# EAGLE design Test (EAGLE 9.1.3)
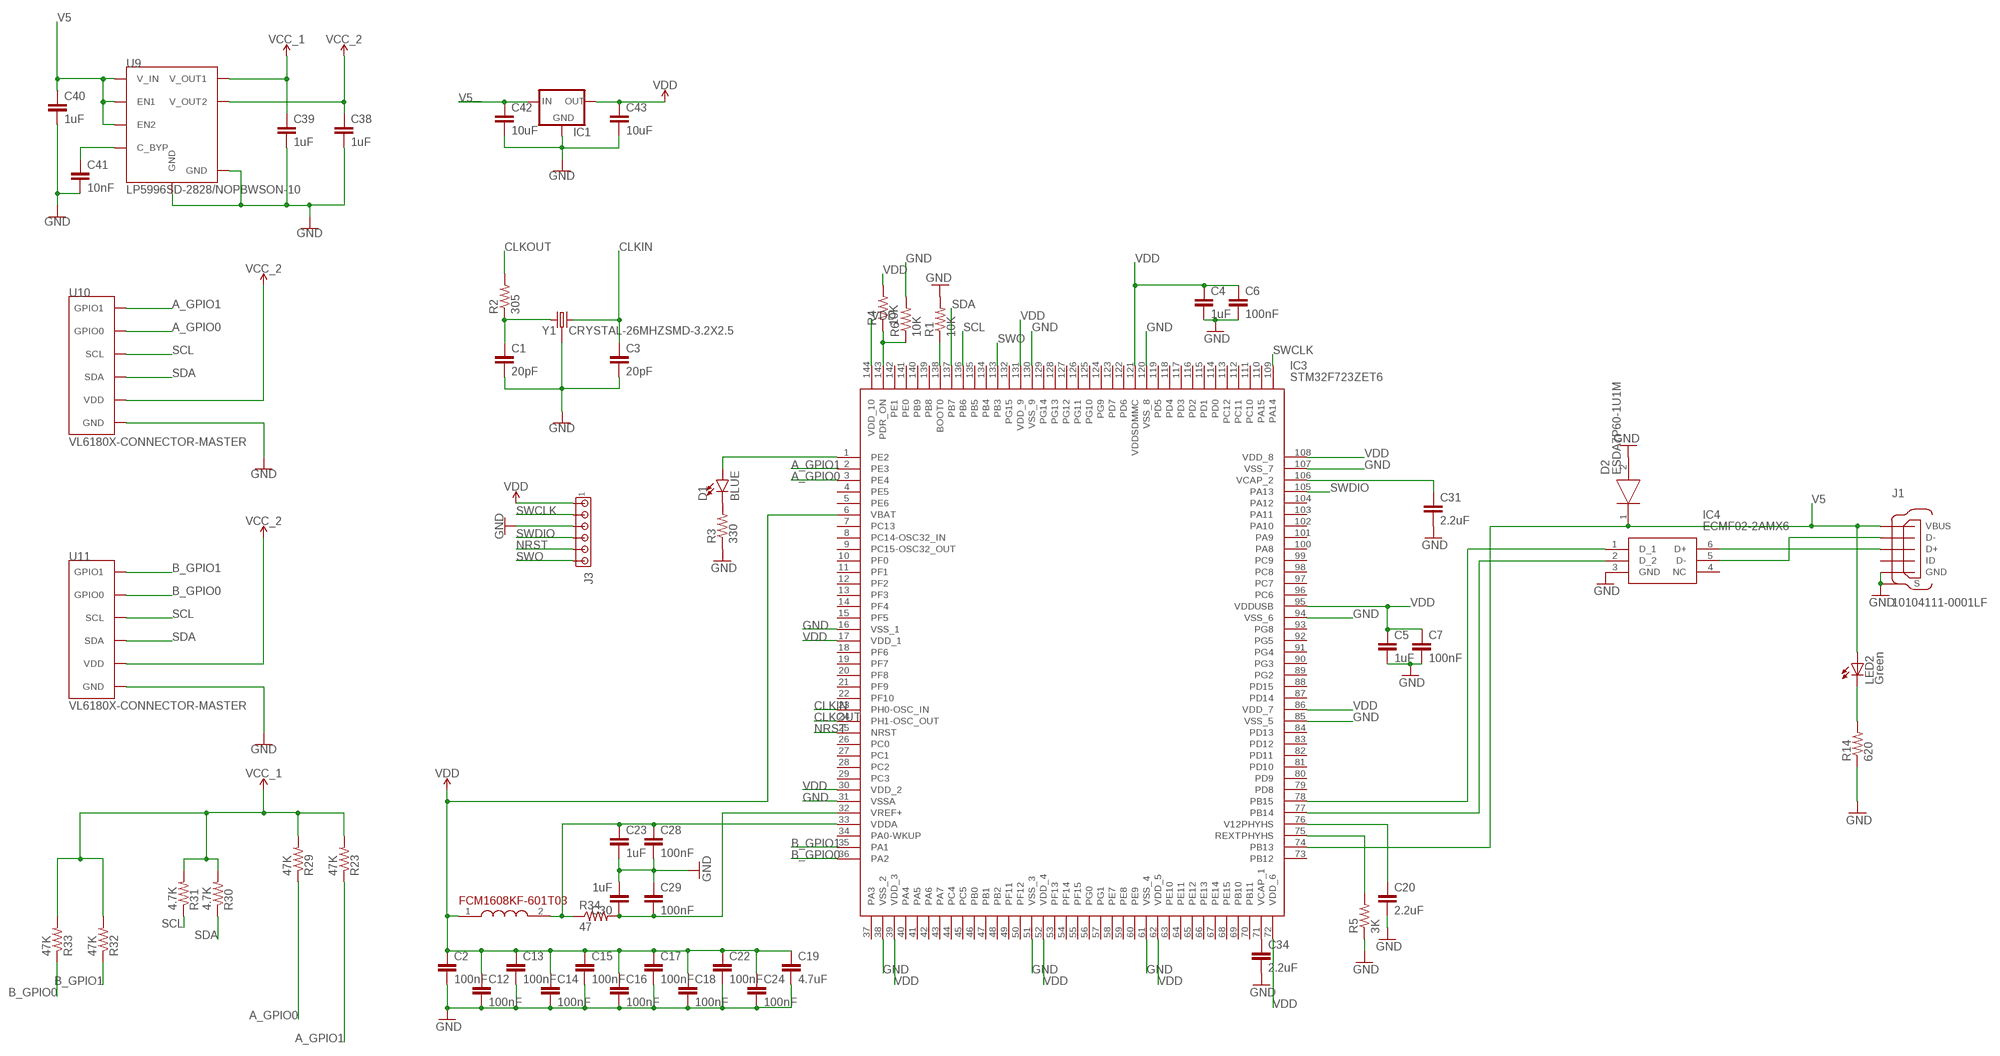
[diagram p0: schematic, sheet 1]

## Parts
C1  20pF  C-EUC0603  [C0603]
C2  100nF  C-EUC0603K  [C0603K]
C3  20pF  C-EUC0603  [C0603]
C4  1uF  C-EUC0603K  [C0603K]
C5  1uF  C-EUC0603K  [C0603K]
C6  100nF  C-EUC0603K  [C0603K]
C7  100nF  C-EUC0603K  [C0603K]
C12  100nF  C-EUC0603K  [C0603K]
C13  100nF  C-EUC0603K  [C0603K]
C14  100nF  C-EUC0603K  [C0603K]
C15  100nF  C-EUC0603K  [C0603K]
C16  100nF  C-EUC0603K  [C0603K]
C17  100nF  C-EUC0603K  [C0603K]
C18  100nF  C-EUC0603K  [C0603K]
C19  4.7uF  C-EUC0603K  [C0603K]
C20  2.2uF  C-EUC0603K  [C0603K]
C22  100nF  C-EUC0603K  [C0603K]
C23  1uF  C-EUC0603K  [C0603K]
C24  100nF  C-EUC0603K  [C0603K]
C28  100nF  C-EUC0603K  [C0603K]
C29  100nF  C-EUC0603K  [C0603K]
C30  1uF  C-EUC0603K  [C0603K]
C31  2.2uF  C-EUC0603K  [C0603K]
C34  2.2uF  C-EUC0603K  [C0603K]
C38  1uF  C-EUC0603K  [C0603K]
C39  1uF  C-EUC0603K  [C0603K]
C40  1uF  C-EUC0603K  [C0603K]
C41  10nF  C-EUC0603K  [C0603K]
C42  10uF  C-EUC0603K  [C0603K]
C43  10uF  C-EUC0603K  [C0603K]
D1  BLUE  LED-BLUE0603  [LED-0603]
D2  ESDA7P60-1U1M  [ESDA7P601U1M]
FCM1608KF  FCM1608KF-601T03  [FCM1608KF-601T03]
IC1  LM1117  [SOT223]
IC3  STM32F723ZET6  [QFP50P2200X2200X160-144N]
IC4  ECMF02-2AMX6  [SON50P150X170X55-6N]
J1  10104111-0001LF  [FRAMATOME_10104111-0001LF]
J3  MTA06-100  [10X06MTA]
LED2  Green  LEDCHIP-LED0603  [CHIP-LED0603]
R1  10K  R-US_R0603  [R0603]
R2  305  R-US_R0603  [R0603]
R3  330  R-US_R0603  [R0603]
R4  10K  R-US_R0603  [R0603]
R5  3K  R-US_R0603  [R0603]
R6  10K  R-US_R0603  [R0603]
R14  620  R-US_R0603  [R0603]
R23  47K  R-US_R0603  [R0603]
R29  47K  R-US_R0603  [R0603]
R30  4.7K  R-US_R0603  [R0603]
R31  4.7K  R-US_R0603  [R0603]
R32  47K  R-US_R0603  [R0603]
R33  47K  R-US_R0603  [R0603]
R34  47  R-US_R0603  [R0603]
U9  LP5996SD-2828/NOPBWSON-10  [WSON-10]
U10  VL6180X-CONNECTOR-MASTER  [FH33-6S-0.5SH(10)-MASTER]
U11  VL6180X-CONNECTOR-MASTER  [FH33-6S-0.5SH(10)-MASTER]
Y1  CRYSTAL-26MHZSMD-3.2X2.5  [CRYSTAL-SMD-3.2X2.5MM]

## Nets
A_GPIO0: IC3.3(PE4) R29.1 U10.2(GPIO0)
A_GPIO1: IC3.2(PE3) R23.1 U10.1(GPIO1)
B_GPIO0: IC3.36(PA2) R33.1 U11.2(GPIO0)
B_GPIO1: IC3.35(PA1) R32.1 U11.1(GPIO1)
CLKIN: C3.1 IC3.23(PH0-OSC_IN) Y1.3
CLKOUT: IC3.24(PH1-OSC_OUT) R2.2
GND: C1.2 C2.2 C3.2 C4.2 C5.2 C6.2 C7.2 C12.2 C13.2 C14.2 C15.2 C16.2 C17.2 C18.2 C19.2 C20.2 C22.2 C23.2 C24.2 C28.2 C29.1 C30.2 C31.2 C34.2 C38.2 C39.2 C40.2 C41.2 C42.2 C43.2 D2.2(A) IC1.1(GND) IC3.16(VSS_1) IC3.31(VSSA) IC3.38(VSS_2) IC3.51(VSS_3) IC3.61(VSS_4) IC3.85(VSS_5) IC3.94(VSS_6) IC3.107(VSS_7) IC3.120(VSS_8) IC3.130(VSS_9) IC4.3(GND) J1.5(GND) J1.6(S) J1.7(S) J1.8(S) J1.9(S) J3.3 R1.2 R3.1 R5.1 R6.2 R14.1 U9.6(GND) U9.11(GND) U10.6(GND) U11.6(GND) Y1.2 Y1.4
N$1: IC3.138(BOOT0) R1.1
N$2: LED2.C R14.2
N$3: C34.1 IC3.71(VCAP_1)
N$4: C20.1 IC3.76(V12PHYHS)
N$5: D1.C R3.2
N$6: C31.1 IC3.106(VCAP_2)
N$7: IC3.78(PB15) IC4.1(D_1)
N$8: IC3.77(PB14) IC4.2(D_2)
N$9: D1.A IC3.1(PE2)
N$10: C23.1 C28.1 FCM1608KF.2(2.OUT) IC3.33(VDDA) R34.1
N$11: IC4.6(D+) J1.3(D+)
N$12: C1.1 R2.1 Y1.1
N$13: IC4.5(D-) J1.2(D-)
N$14: IC3.143(PDR_ON) R4.1 R6.1
N$17: IC3.75(REXTPHYHS) R5.2
N$19: C29.2 C30.1 IC3.32(VREF+) R34.2
N$22: C41.1 U9.4(C_BYP)
NRST: IC3.25(NRST) J3.5
SCL: IC3.136(PB6) R31.1 U10.3(SCL) U11.3(SCL)
SDA: IC3.137(PB7) R30.1 U10.4(SDA) U11.4(SDA)
SWCLK: IC3.109(PA14) J3.2
SWDIO: IC3.105(PA13) J3.4
SWO: IC3.133(PB3) J3.6
V5: C40.1 C42.1 D2.1(K) IC1.3(IN) IC3.74(PB13) J1.1(VBUS) LED2.A U9.1(V_IN) U9.2(EN1) U9.3(EN2)
VCC_1: C39.1 R23.2 R29.2 R30.2 R31.2 R32.2 R33.2 U9.10(V_OUT1)
VCC_2: C38.1 U9.9(V_OUT2) U10.5(VDD) U11.5(VDD)
VDD: C2.1 C4.1 C5.1 C6.1 C7.1 C12.1 C13.1 C14.1 C15.1 C16.1 C17.1 C18.1 C19.1 C22.1 C24.1 C43.1 FCM1608KF.1(1.IN) IC1.2(OUT) IC3.6(VBAT) IC3.17(VDD_1) IC3.30(VDD_2) IC3.39(VDD_3) IC3.52(VDD_4) IC3.62(VDD_5) IC3.72(VDD_6) IC3.86(VDD_7) IC3.95(VDDUSB) IC3.108(VDD_8) IC3.121(VDDSDMMC) IC3.131(VDD_9) IC3.144(VDD_10) J3.1 R4.2
Unconnected: IC3.4(PE5) IC3.5(PE6) IC3.7(PC13) IC3.8(PC14-OSC32_IN) IC3.9(PC15-OSC32_OUT) IC3.10(PF0) IC3.11(PF1) IC3.12(PF2) IC3.13(PF3) IC3.14(PF4) IC3.15(PF5) IC3.18(PF6) IC3.19(PF7) IC3.20(PF8) IC3.21(PF9) IC3.22(PF10) IC3.26(PC0) IC3.27(PC1) IC3.28(PC2) IC3.29(PC3) IC3.34(PA0-WKUP) IC3.37(PA3) IC3.40(PA4) IC3.41(PA5) IC3.42(PA6) IC3.43(PA7) IC3.44(PC4) IC3.45(PC5) IC3.46(PB0) IC3.47(PB1) IC3.48(PB2) IC3.49(PF11) IC3.50(PF12) IC3.53(PF13) IC3.54(PF14) IC3.55(PF15) IC3.56(PG0) IC3.57(PG1) IC3.58(PE7) IC3.59(PE8) IC3.60(PE9) IC3.63(PE10) IC3.64(PE11) IC3.65(PE12) IC3.66(PE13) IC3.67(PE14) IC3.68(PE15) IC3.69(PB10) IC3.70(PB11) IC3.73(PB12) IC3.79(PD8) IC3.80(PD9) IC3.81(PD10) IC3.82(PD11) IC3.83(PD12) IC3.84(PD13) IC3.87(PD14) IC3.88(PD15) IC3.89(PG2) IC3.90(PG3) IC3.91(PG4) IC3.92(PG5) IC3.93(PG8) IC3.96(PC6) IC3.97(PC7) IC3.98(PC8) IC3.99(PC9) IC3.100(PA8) IC3.101(PA9) IC3.102(PA10) IC3.103(PA11) IC3.104(PA12) IC3.110(PA15) IC3.111(PC10) IC3.112(PC11) IC3.113(PC12) IC3.114(PD0) IC3.115(PD1) IC3.116(PD2) IC3.117(PD3) IC3.118(PD4) IC3.119(PD5) IC3.122(PD6) IC3.123(PD7) IC3.124(PG9) IC3.125(PG10) IC3.126(PG11) IC3.127(PG12) IC3.128(PG13) IC3.129(PG14) IC3.132(PG15) IC3.134(PB4) IC3.135(PB5) IC3.139(PB8) IC3.140(PB9) IC3.141(PE0) IC3.142(PE1) IC4.4(NC) J1.4(ID)

## Library data of the parts
C1-C7 C12-C20 C22-C24 C28-C31 C34 C38-C43 = rcl:C-EU: CAPACITOR, European symbol; SPICEPREFIX: C
D1 = SparkFun-LED:LED-BLUE: Blue SMD LED Used in manufacturing of various products at SparkFun Packages: 0603 - SMD 0603 package [Product Link] <http://www.digikey.com/product-detail/en/SMLE12BC7TT86/511-1589-2-ND/1641808> 1206 - SMD1206 package [Product Link] <http://www.digikey.com/product-detail/en/lite-on-inc/LTST-C150TBKT/160-1643-1-ND/573584> SparkFun Products: ESP8266 Thing-Dev Board <https://www.sparkfun.com/products/13711> RedBoard <https://www.sparkfun.com/products/12757>; PROD_ID: DIO-08575
D2 = ESDA7P60-1U1M:ESDA7P60-1U1M: STMicroelectronics ESDA7P60-1U1M Uni-Directional TVS Diode, 700W peak, 2-Pin QFN1610 Source: Datasheet <https://componentsearchengine.com/Datasheets/1/ESDA7P60-1U1M.pdf>; DESCRIPTION: STMicroelectronics ESDA7P60-1U1M Uni-Directional TVS Diode, 700W peak, 2-Pin QFN1610; HEIGHT: 0.6mm; MANUFACTURER_NAME: STMicroelectronics; MANUFACTURER_PART_NUMBER: ESDA7P60-1U1M; MOUSER_PART_NUMBER: 511-ESDA7P60-1U1M; MOUSER_PRICE-STOCK: https://www.mouser.com/Search/Refine.aspx?Keyword=511-ESDA7P60-1U1M
FCM1608KF = FCM1608KF-601T03:FCM1608KF-601T03
IC1 = v-reg-2:LM1117
IC3 = STM32F723ZET6:STM32F723ZET6: STMICROELECTRONICS - STM32F723ZET6 - \u82AF\u7247, \u5FAE\u63A7\u5236\u5668, ARM CORTEX-M7, 216MHZ, LQFP-144 Source: Datasheet <https://componentsearchengine.com/Datasheets/1/STM32F723ZET6.pdf>; DESCRIPTION: STMICROELECTRONICS - STM32F723ZET6 - \u82AF\u7247, \u5FAE\u63A7\u5236\u5668, ARM CORTEX-M7, 216MHZ, LQFP-144; HEIGHT: 1.6mm; MANUFACTURER_NAME: STMicroelectronics; MANUFACTURER_PART_NUMBER: STM32F723ZET6; MOUSER_PART_NUMBER: 511-STM32F723ZET6; MOUSER_PRICE-STOCK: https://www.mouser.com/Search/Refine.aspx?Keyword=511-STM32F723ZET6
IC4 = ECMF02-2AMX6:ECMF02-2AMX6: Common Mode Filter & ESD Prot. USB uQFN6 STMicroelectronics ECMF02 Series, Signal Filter, 200mA uQFN SMD, Flat Contact Termination, 1.8 x 1.6 x 0.5mm Source: Datasheet <https://componentsearchengine.com/Datasheets/1/ECMF02-2AMX6.pdf>; DESCRIPTION: Common Mode Filter & ESD Prot. USB uQFN6 STMicroelectronics ECMF02 Series, Signal Filter, 200mA uQFN SMD, Flat Contact Termination, 1.8 x 1.6 x 0.5mm; HEIGHT: 0.55mm; MANUFACTURER_NAME: STMicroelectronics; MANUFACTURER_PART_NUMBER: ECMF02-2AMX6; MOUSER_PART_NUMBER: 511-ECMF02-2AMX6; MOUSER_PRICE-STOCK: https://www.mouser.com/Search/Refine.aspx?Keyword=511-ECMF02-2AMX6
J1 = 10104111-0001LF:10104111-0001LF: Conn USB Type A/B RCP 5 POS 0.65mm Solder RA SMD 5 Terminal 1 Port T/R; AVAILABILITY: Good; DESCRIPTION: Micro Usb, 2.0 Type Ab, Receptacle, Th; MF: Amphenol ICC; MP: 10104111-0001LF; PACKAGE: None; PRICE: 0.50 USD
J3 = con-amp:MTA06-100: AMP connector Connection corrected 2014-09-19
LED2 = led:LED: LED OSRAM: - CHIPLED LG R971, LG N971, LY N971, LG Q971, LY Q971, LO R971, LY R971 LH N974, LH R974 LS Q976, LO Q976, LY Q976 LO Q996 - Hyper CHIPLED LW Q18S LB Q993, LB Q99A, LB R99A - SideLED LS A670, LO A670, LY A670, LG A670, LP A670 LB A673, LV A673, LT A673, LW A673 LH A674 LY A675 LS A676, LA A676, LO A676, LY A676, LW A676 LS A679, LY A679, LG A679 - Hyper Micro SIDELED® LS Y876, LA Y876, LO Y876, LY Y876 LT Y87S - SmartLED LW L88C, LW L88S LB L89C, LB L89S, LG L890 LS L89K, LO L89K, LY L89K LS L896, LA L896, LO L896, LY L896 - TOPLED LS T670, LO T670, LY T670, LG T670, LP T670 LSG T670, LSP T670, LSY T670, LOP T670, LYG T670 LG T671, LOG T671, LSG T671 LB T673, LV T673, LT T673, LW T673 LH T674 LS T676, LA T676, LO T676, LY T676, LB T676, LH T676, LSB T676, LW T676 LB T67C, LV T67C, LT T67C, LS T67K, LO T67K, LY T67K, LW E67C LS E67B, LA E67B, LO E67B, LY E67B, LB E67C, LV E67C, LT E67C LW T67C LS T679, LY T679, LG T679 LS T770, LO T770, LY T770, LG T770, LP T770 LB T773, LV T773, LT T773, LW T773 LH T774 LS E675, LA E675, LY E675, LS T675 LS T776, LA T776, LO T776, LY T776, LB T776 LHGB T686 LT T68C, LB T68C - Hyper Mini TOPLED® LB M676 - Mini TOPLED Santana® LG M470 LS M47K, LO M47K, LY M47K Source: http://www.osram.convergy.de LUXEON: - LUMILED® LXK2-PW12-R00, LXK2-PW12-S00, LXK2-PW14-U00, LXK2-PW14-V00 LXK2-PM12-R00, LXK2-PM12-S00, LXK2-PM14-U00 LXK2-PE12-Q00, LXK2-PE12-R00, LXK2-PE12-S00, LXK2-PE14-T00, LXK2-PE14-U00 LXK2-PB12-K00, LXK2-PB12-L00, LXK2-PB12-M00, LXK2-PB14-N00, LXK2-PB14-P00, LXK2-PB14-Q00 LXK2-PR12-L00, LXK2-PR12-M00, LXK2-PR14-Q00, LXK2-PR14-R00 LXK2-PD12-Q00, LXK2-PD12-R00, LXK2-PD12-S00 LXK2-PH12-R00, LXK2-PH12-S00 LXK2-PL12-P00, LXK2-PL12-Q00, LXK2-PL12-R00 Source: www.luxeon.com KINGBRIGHT: KA-3528ASYC Source: www.kingbright.com
R1-R6 R14 R23 R29-R34 = rcl:R-US_: RESISTOR, American symbol; SPICEPREFIX: R
U9 = optical_tof_lib:LP5996SD-2828/NOPB: Dual 2.8V Output LDO. Vo1 supplies up to 150ma, Vo2 supplies up to 300ma - LP5996SD-2828/NOPB <http://www.ti.com/lit/ds/symlink/lp5996.pdf>
U10 U11 = optical_tof_lib:VL6180X-CONNECTOR-MASTER: A connector that goes on the master board (i.e board that has microcontroller) in order to connect with a VL6180X sensor through a flex cable Connector <https://www.digikey.com/product-detail/en/hirose-electric-co-ltd/FH33-6S-0.5SH(10)/HFS06CT-ND/1305357> VL6180X <http://www.st.com/content/ccc/resource/technical/document/datasheet/c4/11/28/86/e6/26/44/b3/DM00112632.pdf/files/DM00112632.pdf/jcr:content/translations/en.DM00112632.pdf>
Y1 = SparkFun-Clocks:CRYSTAL-26MHZ: 26MHz Crystal w/ Ground Pin Digikey Example <http://www.digikey.com/product-detail/en/epson/TSX-3225%2026.0000MF09Z-AC3/SER3627CT-ND/1802878> Frequency: 26MHz Frequency Stability: ±9ppm Frequency Tolerance: ±10ppm Load Capacitance: 9pF SparkFun Products: SparkFun ESP32 Thing <https://www.sparkfun.com/products/13907> SparkFun ESP8266 Thing Dev Board <https://www.sparkfun.com/products/13711>; PROD_ID: XTAL-12454

## Net classes
0 default: drill 0.356 mm

## Board
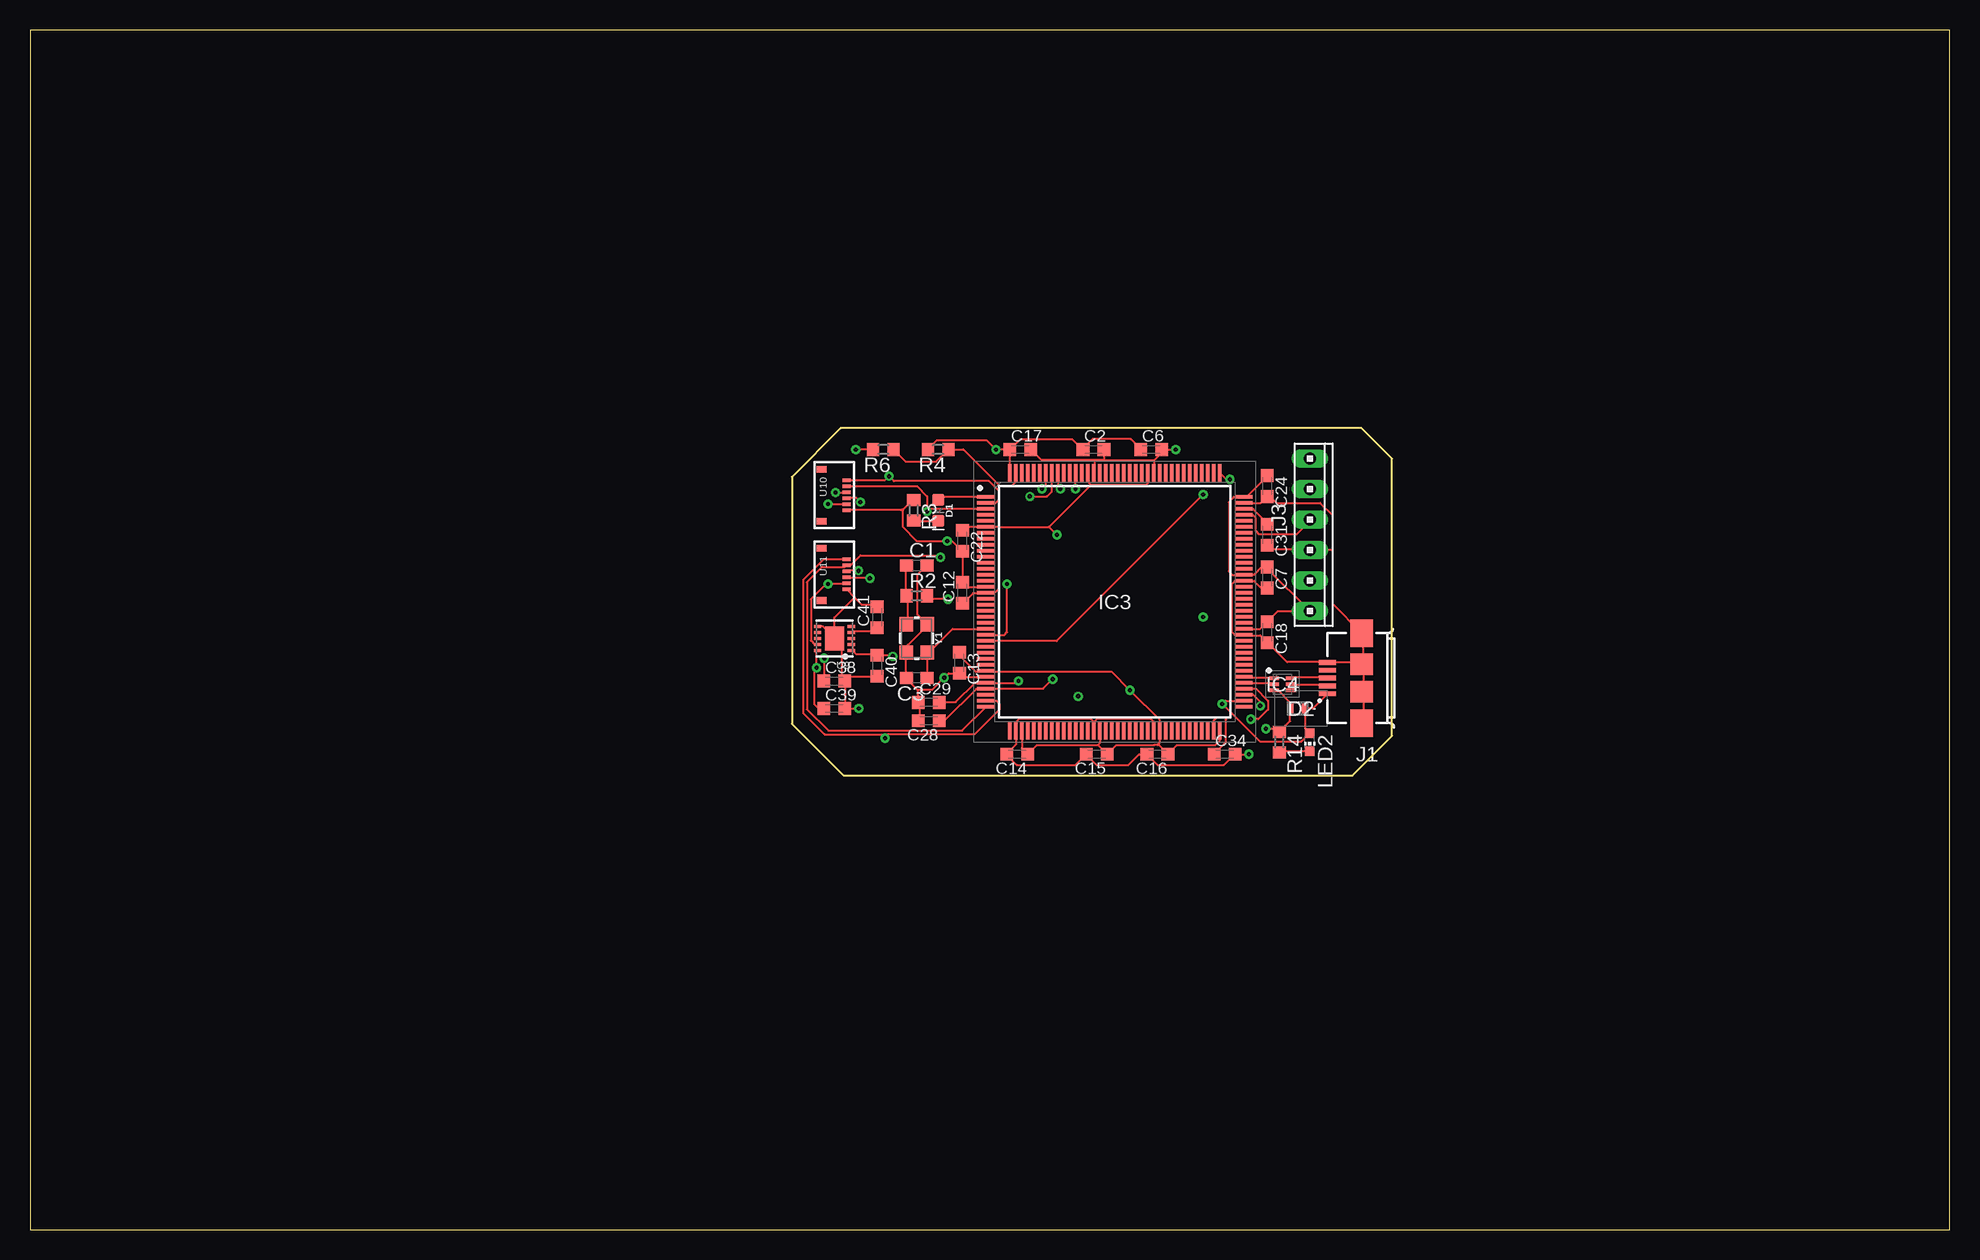
[diagram p1: board, top side]
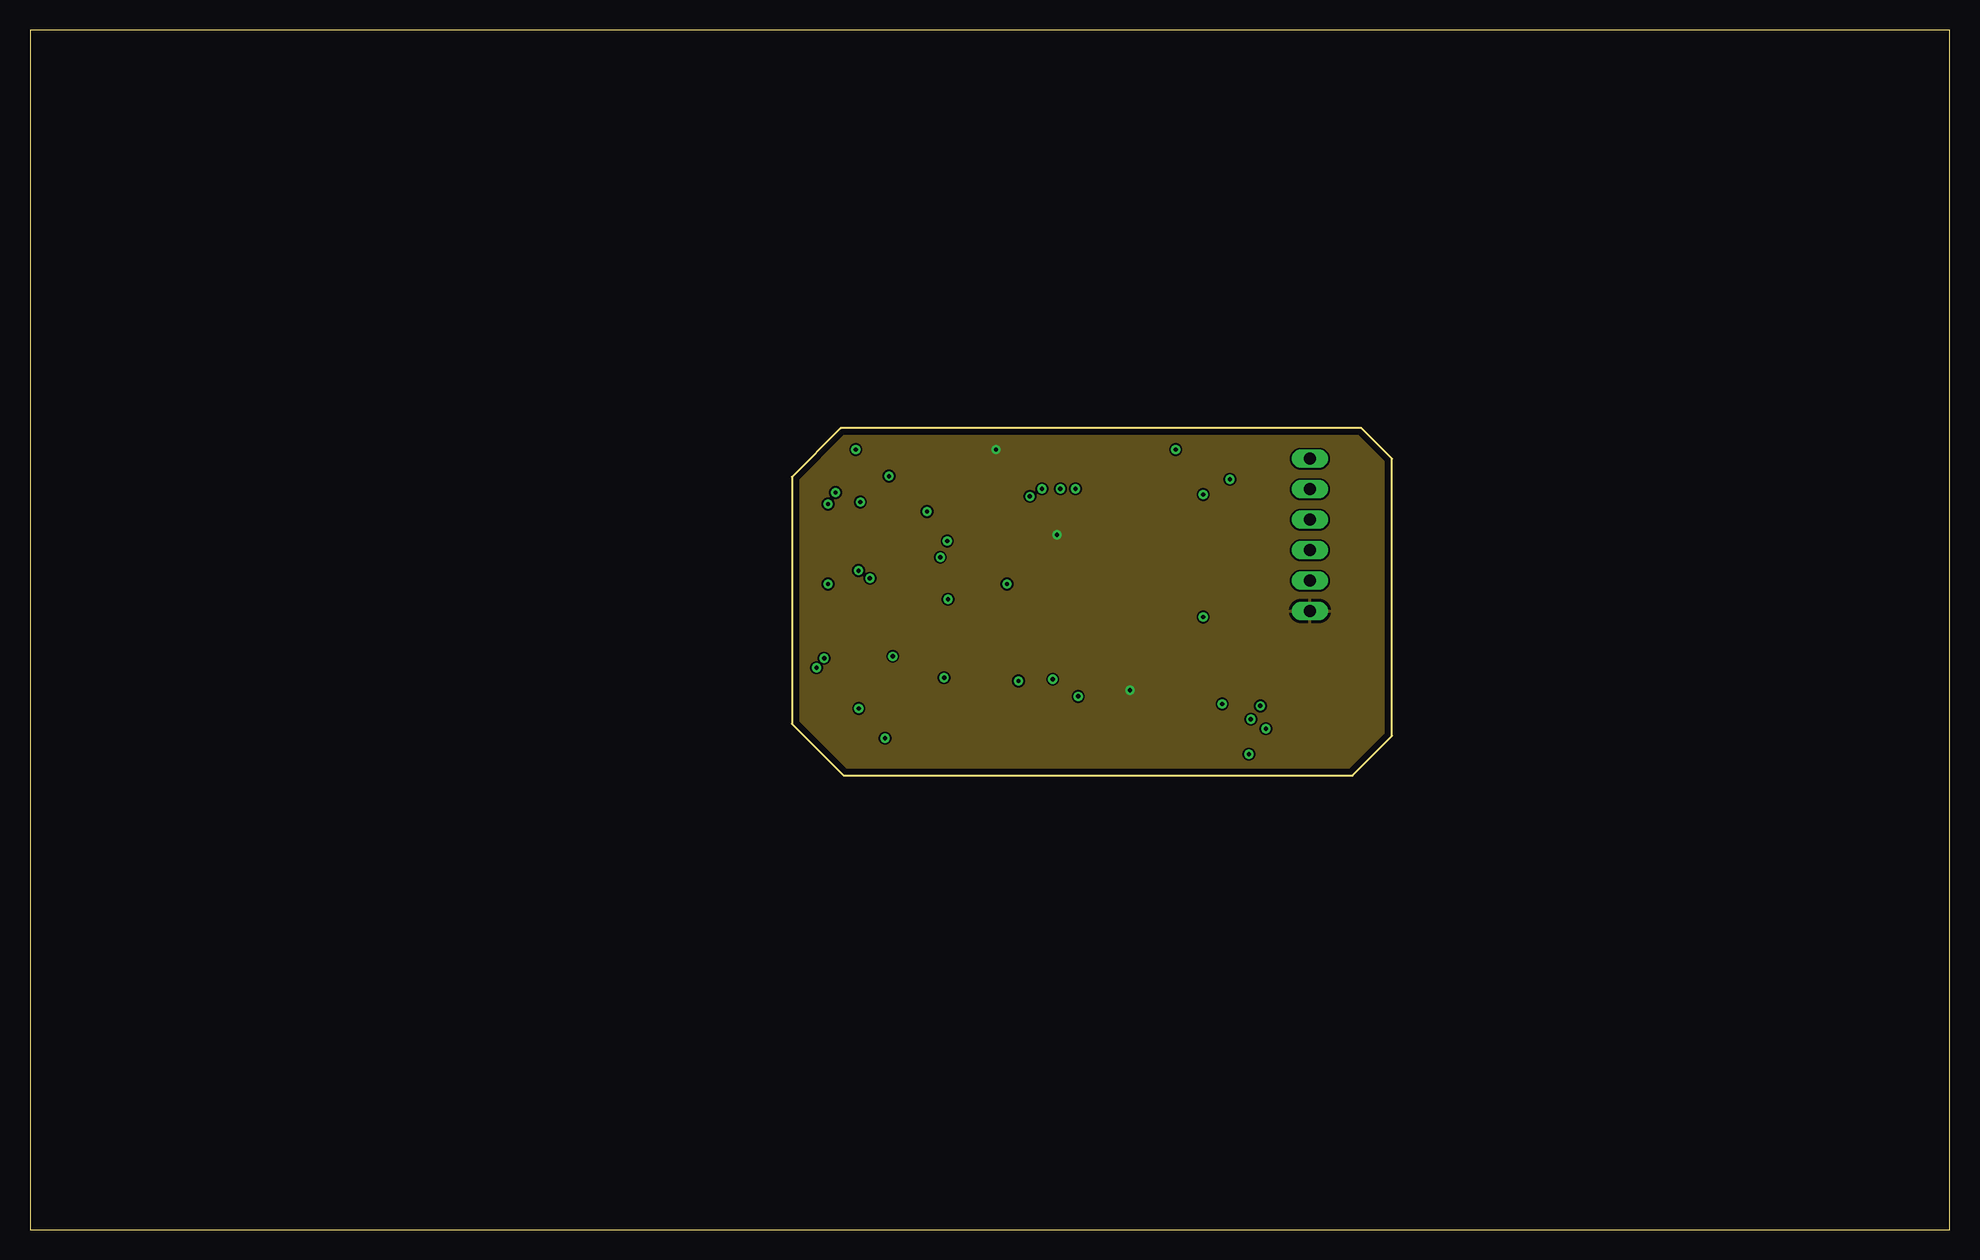
[diagram p2: board, inner layer Route2]
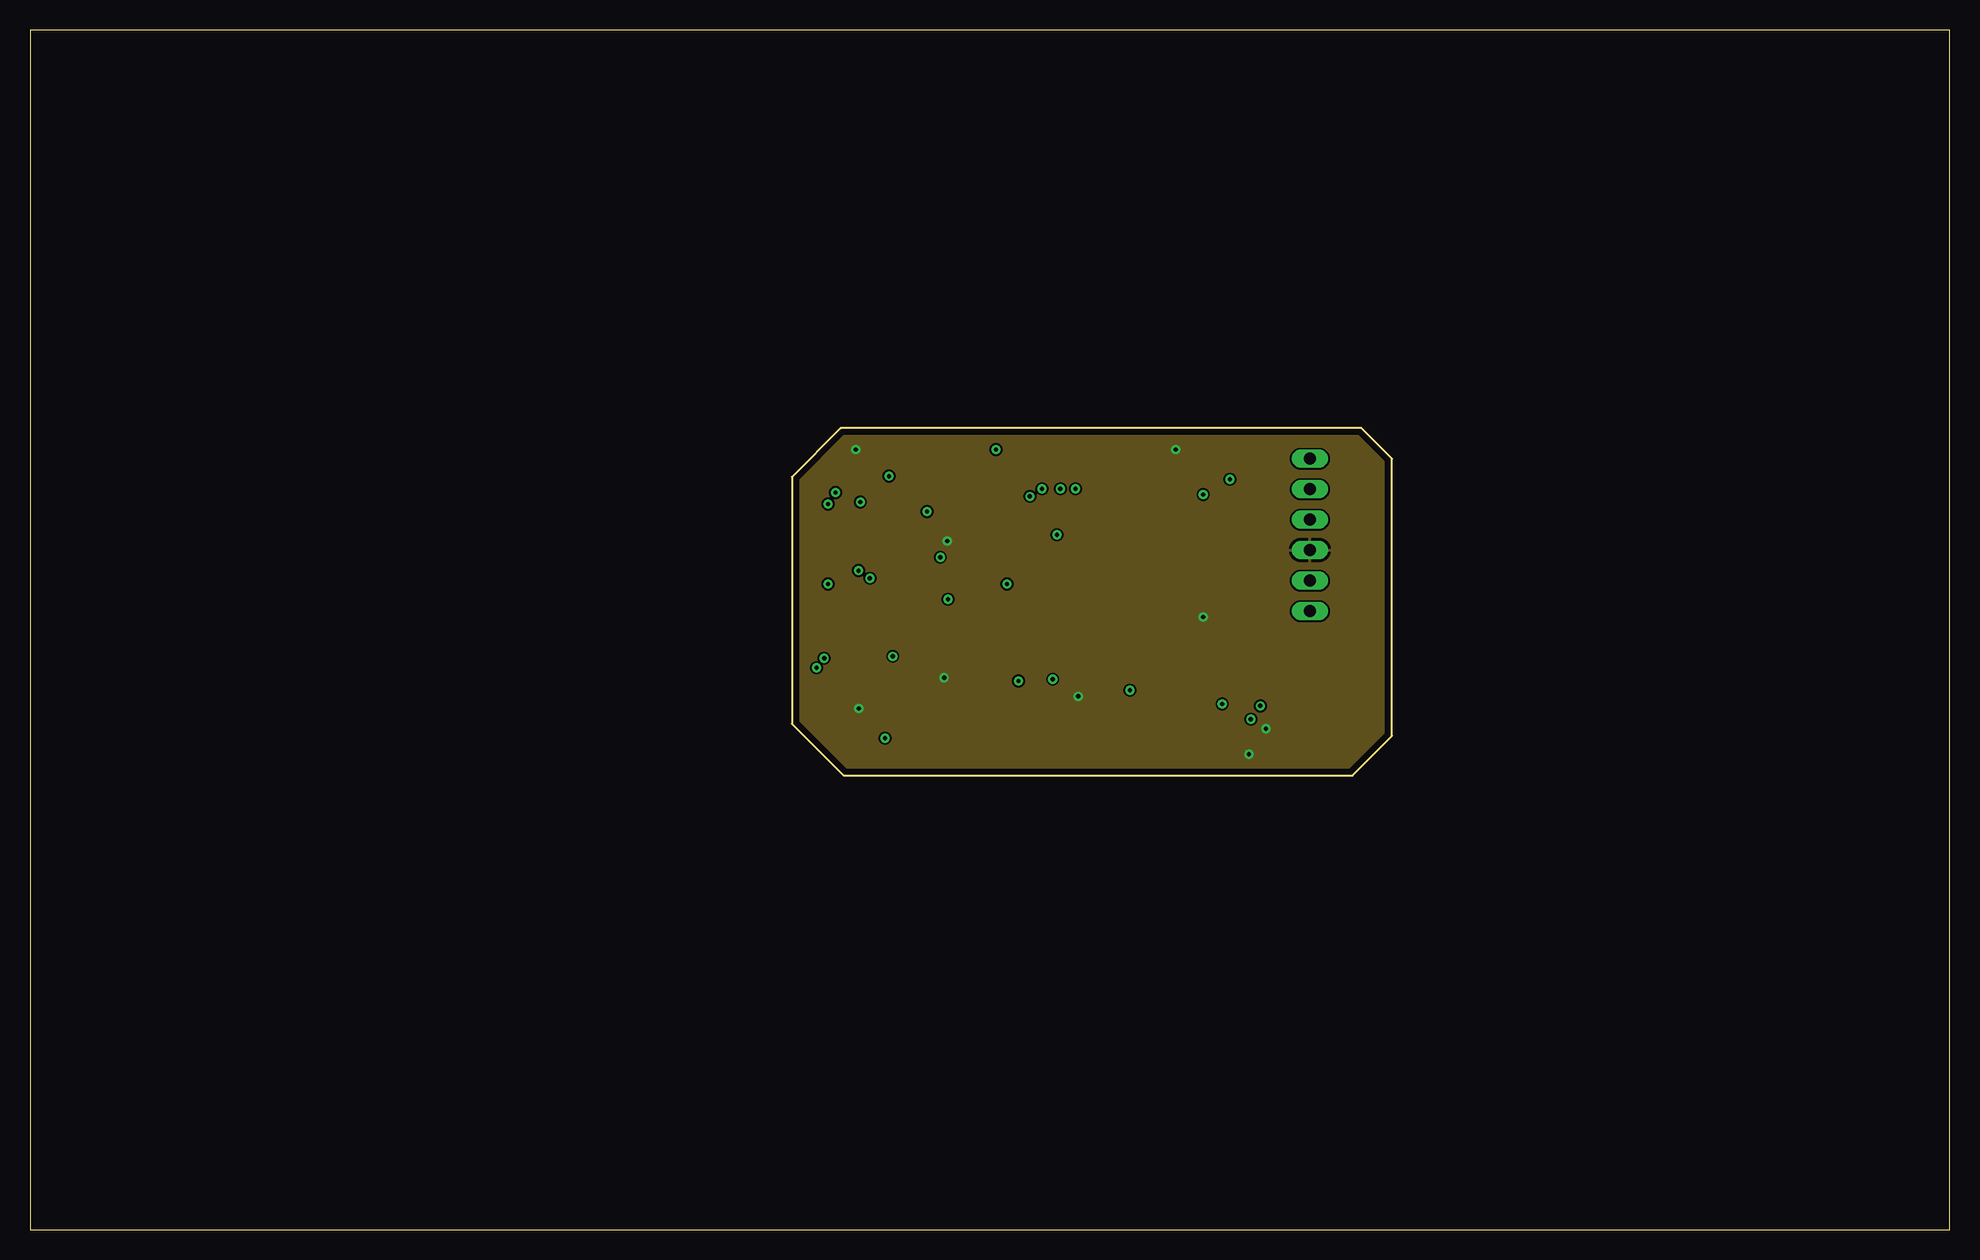
[diagram p3: board, inner layer Route15]
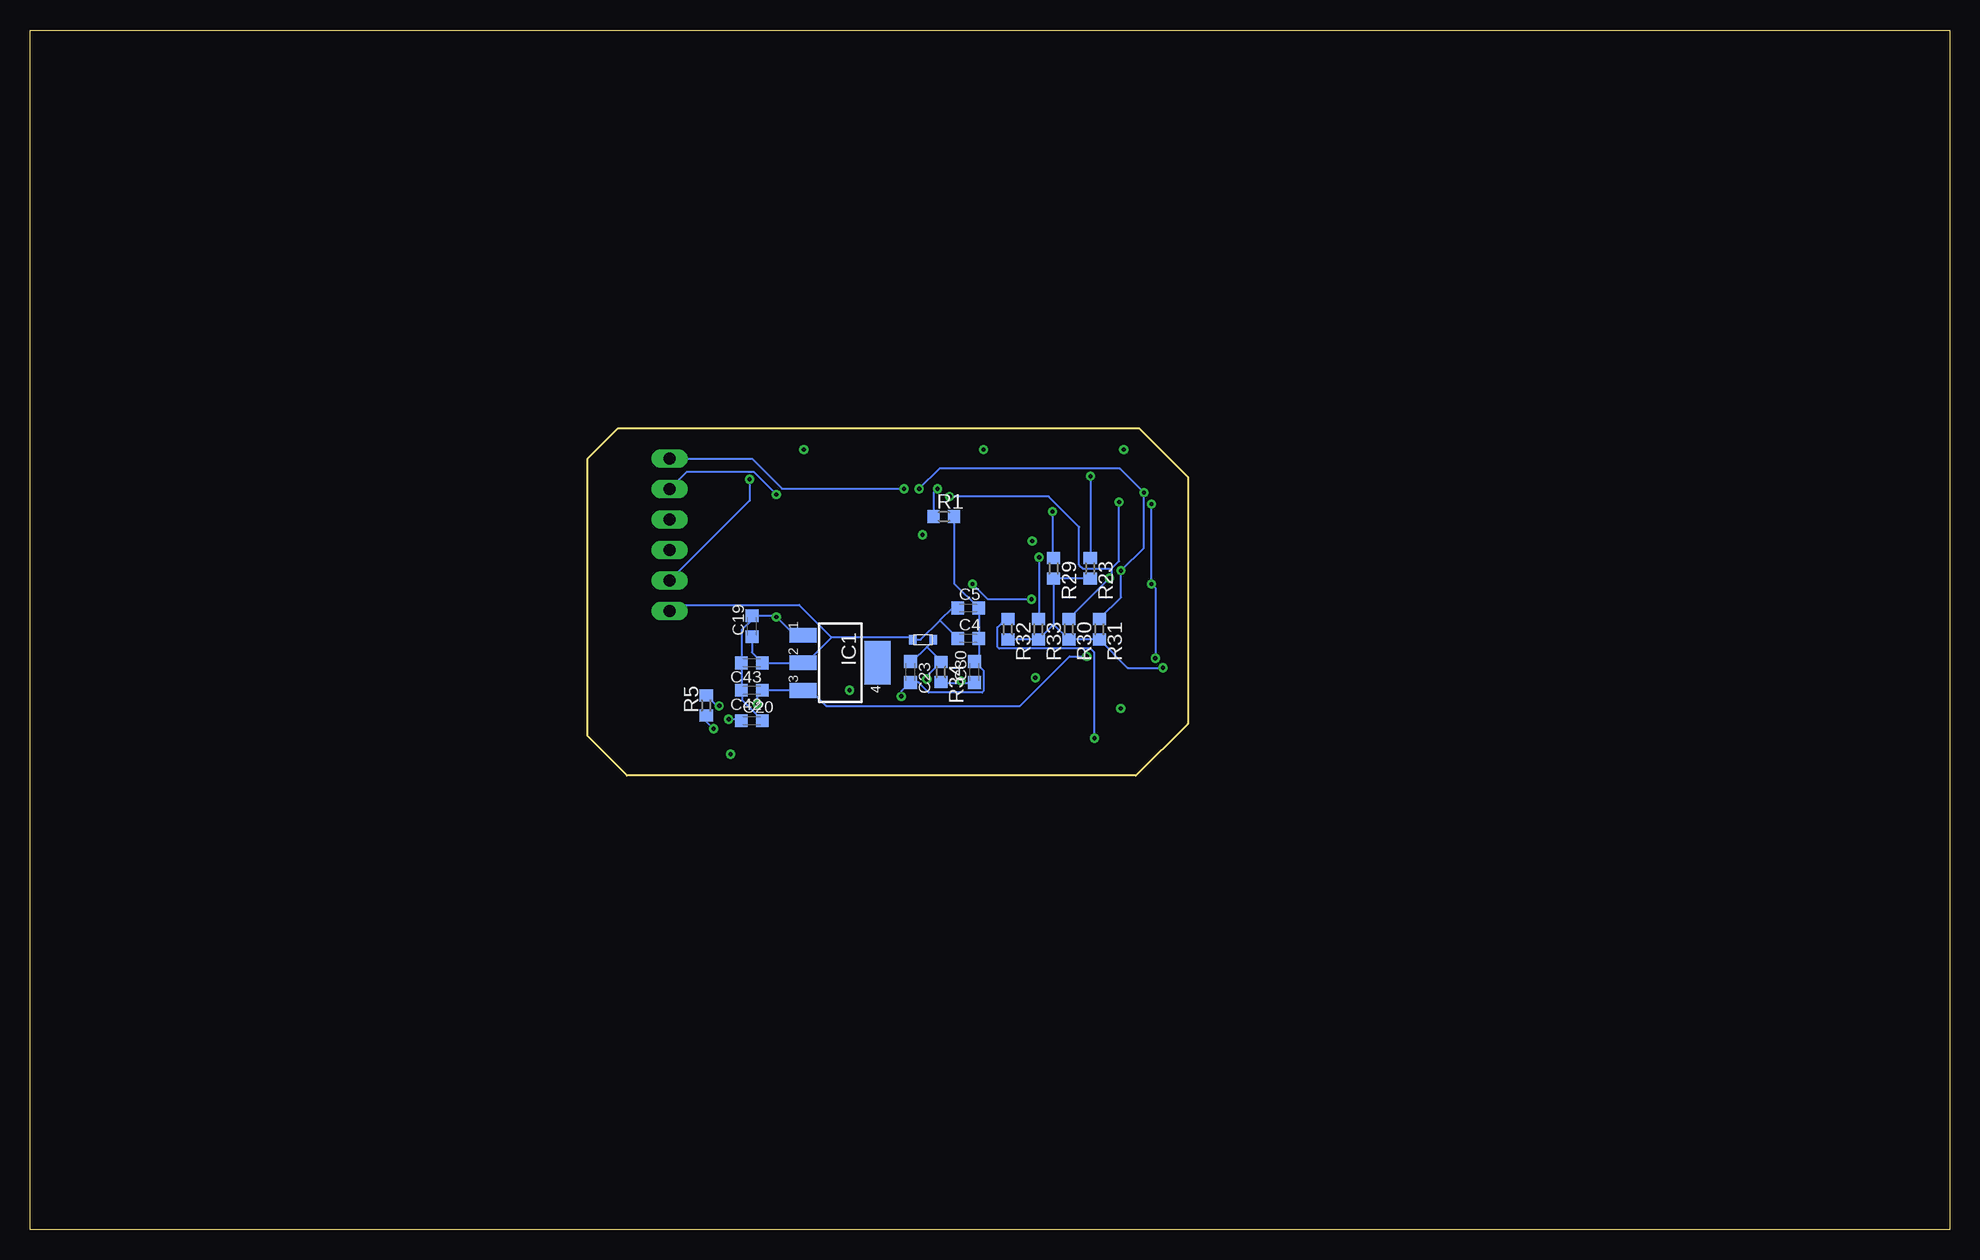
[diagram p4: board, bottom side, seen from below]

Size 160 x 100 mm. Coordinates in mm from the lower left corner, seen from the top.
Outline: 0,0 160,0 160,100 0,100 0,0
Outline: 67.56,66.8 63.5,62.74 63.5,42.16 67.82,37.85 110.24,37.85 113.54,41.15 113.54,64.26 111,66.8 67.56,66.8
Copper layers (1+2*15+16): Top 0.0178mm / dielectric 12mil / Route2 0.0356mm / dielectric 28mil / Route15 0.0356mm / dielectric 12mil / Bottom 0.0178mm
Design rules "SSC-EAGLE-4Lyr_v1.0.0.3 *": minimum track width 6mil, minimum drill 8mil, track to track 6mil, track to pad 6mil, pad to pad 6mil, via to via 6mil, smd to smd 6mil, copper to edge 20mil, drill to drill 16mil, minimum pad ring 8mil, minimum via ring 8mil, stop-mask expansion 3mil, vias tented up to drill 14mil, thermal gap 10mil

### Footprints (pad centres in the part's own frame; a part is rotated, then mirrored left to right if it is on the bottom)
C0603 = smd 1.1 x 1: 1 -0.85,0; 2 0.85,0
C0603K = smd 1.05 x 1.08: 1 -0.875,0; 2 0.875,0
LED-0603 = smd 1 x 1: A -0.877,0; C 0.877,0
ESDA7P601U1M = smd 0.55 x 0.8: 1 -0.625,0; 2 0.625,0
FCM1608KF-601T03 = smd 0.6 x 0.8: 1 -0.05,0.4; 2 1.65,0.4
SOT223 = smd 1.219 x 2.235: 1 -2.311,-3.099; 2 0,-3.099; 3 2.311,-3.099 | smd 3.6 x 2.2: 4 0,3.099
QFP50P2200X2200X160-144N = smd 1.475 x 0.3: 1 -10.738,8.75; 2 -10.738,8.25; 3 -10.738,7.75; 4 -10.738,7.25; 5 -10.738,6.75; 6 -10.738,6.25; 7 -10.738,5.75; 8 -10.738,5.25; 9 -10.738,4.75; 10 -10.738,4.25; 11 -10.738,3.75; 12 -10.738,3.25; 13 -10.738,2.75; 14 -10.738,2.25; 15 -10.738,1.75; 16 -10.738,1.25; 17 -10.738,0.75; 18 -10.738,0.25; 19 -10.738,-0.25; 20 -10.738,-0.75; 21 -10.738,-1.25; 22 -10.738,-1.75; 23 -10.738,-2.25; 24 -10.738,-2.75; 25 -10.738,-3.25; 26 -10.738,-3.75; 27 -10.738,-4.25; 28 -10.738,-4.75; 29 -10.738,-5.25; 30 -10.738,-5.75; 31 -10.738,-6.25; 32 -10.738,-6.75; 33 -10.738,-7.25; 34 -10.738,-7.75; 35 -10.738,-8.25; 36 -10.738,-8.75; 73 10.738,-8.75; 74 10.738,-8.25; 75 10.738,-7.75; 76 10.738,-7.25; 77 10.738,-6.75; 78 10.738,-6.25; 79 10.738,-5.75; 80 10.738,-5.25; 81 10.738,-4.75; 82 10.738,-4.25; 83 10.738,-3.75; 84 10.738,-3.25; 85 10.738,-2.75; 86 10.738,-2.25; 87 10.738,-1.75; 88 10.738,-1.25; 89 10.738,-0.75; 90 10.738,-0.25; 91 10.738,0.25; 92 10.738,0.75; 93 10.738,1.25; 94 10.738,1.75; 95 10.738,2.25; 96 10.738,2.75; 97 10.738,3.25; 98 10.738,3.75; 99 10.738,4.25; 100 10.738,4.75; 101 10.738,5.25; 102 10.738,5.75; 103 10.738,6.25; 104 10.738,6.75; 105 10.738,7.25; 106 10.738,7.75; 107 10.738,8.25; 108 10.738,8.75 | smd 0.3 x 1.475: 37 -8.75,-10.738; 38 -8.25,-10.738; 39 -7.75,-10.738; 40 -7.25,-10.738; 41 -6.75,-10.738; 42 -6.25,-10.738; 43 -5.75,-10.738; 44 -5.25,-10.738; 45 -4.75,-10.738; 46 -4.25,-10.738; 47 -3.75,-10.738; 48 -3.25,-10.738; 49 -2.75,-10.738; 50 -2.25,-10.738; 51 -1.75,-10.738; 52 -1.25,-10.738; 53 -0.75,-10.738; 54 -0.25,-10.738; 55 0.25,-10.738; 56 0.75,-10.738; 57 1.25,-10.738; 58 1.75,-10.738; 59 2.25,-10.738; 60 2.75,-10.738; 61 3.25,-10.738; 62 3.75,-10.738; 63 4.25,-10.738; 64 4.75,-10.738; 65 5.25,-10.738; 66 5.75,-10.738; 67 6.25,-10.738; 68 6.75,-10.738; 69 7.25,-10.738; 70 7.75,-10.738; 71 8.25,-10.738; 72 8.75,-10.738; 109 8.75,10.738; 110 8.25,10.738; 111 7.75,10.738; 112 7.25,10.738; 113 6.75,10.738; 114 6.25,10.738; 115 5.75,10.738; 116 5.25,10.738; 117 4.75,10.738; 118 4.25,10.738; 119 3.75,10.738; 120 3.25,10.738; 121 2.75,10.738; 122 2.25,10.738; 123 1.75,10.738; 124 1.25,10.738; 125 0.75,10.738; 126 0.25,10.738; 127 -0.25,10.738; 128 -0.75,10.738; 129 -1.25,10.738; 130 -1.75,10.738; 131 -2.25,10.738; 132 -2.75,10.738; 133 -3.25,10.738; 134 -3.75,10.738; 135 -4.25,10.738; 136 -4.75,10.738; 137 -5.25,10.738; 138 -5.75,10.738; 139 -6.25,10.738; 140 -6.75,10.738; 141 -7.25,10.738; 142 -7.75,10.738; 143 -8.25,10.738; 144 -8.75,10.738
SON50P150X170X55-6N = smd 0.85 x 0.3: 1 -0.7,0.5; 2 -0.7,0; 3 -0.7,-0.5; 4 0.7,-0.5; 5 0.7,0; 6 0.7,0.5
FRAMATOME_10104111-0001LF = smd 0.4 x 1.4: 1 -1.3,2.85; 2 -0.65,2.85; 3 0,2.85; 4 0.65,2.85; 5 1.3,2.85 | smd 2.3 x 1.9: 6 -3.75,0; 9 3.75,0 | smd 1.8 x 1.9: 7 -1.15,0; 8 1.15,0
10X06MTA = drill 1.016 long: 1 6.35,0; 2 3.81,0; 3 1.27,0; 4 -1.27,0; 5 -3.81,0; 6 -6.35,0
CHIP-LED0603 = smd 0.8 x 0.8: A 0,-0.75; C 0,0.75
R0603 = smd 1 x 1.1: 1 -0.85,0; 2 0.85,0
WSON-10 = smd 0.25 x 0.6: 1 -1,-1.4; 2 -0.5,-1.4; 3 0,-1.4; 4 0.5,-1.4; 5 1,-1.4; 6 1,1.4; 7 0.5,1.4; 8 0,1.4; 9 -0.5,1.4; 10 -1,1.4 | smd 2 x 1.6: 11 0,0
FH33-6S-0.5SH(10)-MASTER = smd 0.55 x 0.8: 0A -2.175,-1.075; 0B 2.175,-1.075 | smd 0.3 x 0.65: 1 -1.25,1; 2 -0.75,1; 3 -0.25,1; 4 0.25,1; 5 0.75,1; 6 1.25,1
CRYSTAL-SMD-3.2X2.5MM = smd 1.2 x 1.1: 1 -1.175,-0.875; 2 1.175,-0.875; 3 1.175,0.875; 4 -1.175,0.875

### Placement (x,y rotation side)
C1  73.91,55.37 0 top
C2  88.65,65.02 0 top
C3  73.91,45.97 180 top
C4  81.79,49.28 0 bottom
C5  81.79,51.82 0 bottom
C6  93.47,65.02 0 top
C7  103.12,54.36 270 top
C12  77.72,53.09 90 top
C13  77.47,47.24 270 top
C14  82.3,39.62 180 top
C15  88.9,39.62 180 top
C16  93.98,39.62 180 top
C17  82.55,65.02 0 top
C18  103.12,49.78 270 top
C19  99.82,50.29 90 bottom
C20  99.82,42.42 0 bottom
C22  77.72,57.4 270 top
C23  86.61,46.48 270 bottom
C24  103.12,61.98 270 top
C28  74.93,42.42 180 top
C29  74.93,43.94 0 top
C30  81.28,46.48 90 bottom
C31  103.12,57.91 270 top
C34  99.57,39.62 0 top
C38  67.06,45.72 0 top
C39  67.06,43.43 0 top
C40  70.61,46.99 270 top
C41  70.61,51.05 90 top
C42  99.82,44.96 180 bottom
C43  99.82,47.24 180 bottom
D1  75.69,59.94 270 top
D2  105.66,43.43 180 top
FCM1608KF  86.36,48.77 0 bottom
IC1  92.46,47.24 270 bottom
IC3  90.42,52.32 0 top
IC4  104.39,45.47 0 top
J1  111,45.97 90 top
J3  106.68,57.91 270 top
LED2  106.68,40.64 180 top
R1  83.82,59.44 0 bottom
R2  73.91,52.83 0 top
R3  73.66,59.94 270 top
R4  75.69,65.02 180 top
R5  103.63,43.69 90 bottom
R6  71.12,65.02 180 top
R14  104.14,40.64 270 top
R23  71.63,55.12 270 bottom
R29  74.68,55.12 270 bottom
R30  73.41,50.04 270 bottom
R31  70.87,50.04 270 bottom
R32  78.49,50.04 270 bottom
R33  75.95,50.04 270 bottom
R34  84.07,46.48 270 bottom
U9  67.06,49.28 90 top
U10  67.06,61.21 270 top
U11  67.06,54.61 270 top
Y1  73.91,49.28 270 top

### Tracks (layer width: path | path; a pad name or v marks a point on that pad's centre or on a via)
A_GPIO0  (via drill 0.36)
  Top 0.152: IC3.3 75,60.07 v74.77,59.85 74.77,61.12 73.93,61.96 U10.2
  Bottom 0.152: v74.77,59.85 74.77,56.04 R29.1
A_GPIO1  (via drill 0.36)
  Top 0.152: IC3.2 80.48,60.57 80.8,60.9 80.8,61.53 79.95,62.39 72.01,62.39 v71.6,62.8 71.26,62.46 U10.1
  Bottom 0.152: v71.6,62.8 71.6,56 R23.1
B_GPIO0  (via drill 0.36)
  Top 0.152: v75.88,56.04 75.72,56.2 69.22,56.2 68.42,55.4 68.1,55.4 U11.2 67.94,55.24 66.04,55.24 64.77,53.98 64.77,43.37 66.55,41.59 77.7,41.59 IC3.36
  Bottom 0.152: v75.88,56.04 75.88,50.95 R33.1
B_GPIO1  (via drill 0.36)
  Top 0.152: 71.28,41.27 78.74,41.27 80.8,43.34 80.8,43.82 80.55,44.07 IC3.35 | 71.28,41.27 66.23,41.27 64.45,43.05 64.45,54.13 66.2,55.88 67.94,55.88 U11.1 | 71.28,41.27 v71.28,40.96
  Bottom 0.152: v71.28,40.96 71.28,48.1 71.6,48.42 79.22,48.42 79.38,48.58 79.38,50.2 78.68,50.89 R32.1
CLKIN
  Top 0.152: C3.1 74.77,46.04 74.77,47.94 Y1.3 74.93,48.1 76.9,50.07 IC3.23
CLKOUT  (via drill 0.36)
  Top 0.152: v76.52,52.55 74.93,52.55 74.77,52.7 R2.2 | IC3.24 81.21,49.57 81.44,49.8 v81.44,53.82
  Bottom 0.152: v76.52,52.55 80.17,52.55 v81.44,53.82
GND  (via drill 0.36)
  Top 0.152: 89.52,64.14 88.74,64.14 | C2.2 89.52,64.14 | 88.74,64.14 88.74,63.18 IC3.130 | 106.68,56.67 103.5,56.67 103.19,56.99 C31.2 | 108.58,56.67 108.58,59.53 107.54,60.58 103.89,60.58 103.36,61.1 C24.2 102.6,60.57 IC3.107 | 106.68,56.67 J3.3 | J1.8 110.85,47.27 J1.5 108.11,47.31 104.78,47.31 103.19,48.9 C18.2 103.03,49.05 102.55,49.53 101.28,49.53 IC3.85 100.42,49.57 100.17,49.83 100.17,53.82 100.42,54.07 IC3.94 102.02,54.07 102.62,53.48 C7.2 | J1.8 111.12,46.99 111.12,44.93 J1.7 111.12,44.77 111.12,42.23 J1.6 | J1.8 111.12,47.15 111.12,49.69 J1.9 108.58,52.14 108.58,56.67 | 72.77,60.01 72.68,60.01 72.63,59.96 U10.6 | 68.74,52.7 69.37,52.07 70.48,52.07 C41.2 | 68.74,52.7 68.1,53.34 U11.6 | C28.2 74.14,42.55 74.14,43.81 C29.1 73.98,43.97 73.98,44.99 | 73.98,44.99 73.06,45.91 C3.2 73.03,46.04 73.03,47.94 Y1.2 73.18,48.1 73.18,48.74 74.77,50.32 Y1.4 73.98,51.26 73.98,54.59 C1.2 | C38.2 67.94,45.72 67.94,43.5 C39.2 v69.09,43.43 | v95.5,65.02 C6.2 94.35,64.77 93.67,64.1 | v101.6,39.62 C34.2 100.42,39.62 99.54,38.73 93.99,38.73 C16.2 92.46,39.62 91.57,38.73 88.9,38.73 88.11,39.53 C15.2 87.95,39.53 87.15,38.73 82.23,38.73 81.44,39.53 C14.2 81.44,39.69 82.17,40.42 IC3.38 82.17,42.3 82.43,42.55 88.42,42.55 88.67,42.3 | 88.74,64.14 84.33,64.14 83.44,65.02 C17.2 | 72.77,60.01 72.77,58.55 73.91,57.4 v76.45,57.4 76.85,57.4 C22.2 C12.2 78.11,53.57 IC3.16 | 72.77,60.01 73.56,60.79 R3.1 | 73.98,44.99 75.19,44.99 v76.2,46.01 76.56,46.37 C13.2 77.77,46.07 IC3.31 | U9.11 67.68,48.66 67.68,45.97 C38.2 | U9.6 66.09,50.28 67.06,49.31 U9.11 | U9.11 67.06,51.02 68.74,52.7 | 106.68,56.67 108.58,56.67
  Top 0.152: v103.03,41.75 v103.04,41.74 103.89,41.74 R14.1 105.04,42.39 D2.2 105.04,43.94 104.02,44.97 IC4.3 | 93.67,64.1 93.67,64.14 89.52,64.14 | 93.67,64.1 IC3.120 | C38.2 68.33,46.12 C40.2 | 88.67,42.3 88.93,42.55 93.42,42.55 93.67,42.3 IC3.61 | 88.67,42.3 IC3.51 | R6.2 v68.83,65.02
  Bottom 0.152: C20.2 99.06,42.55 100.65,44.13 100.65,44.91 C42.2 C43.2 100.65,47.31 100.65,50.01 99.82,50.83 C19.2 97.9,51.17 v97.79,51.05 96.29,49.55 IC1.1 | v103.03,41.75 103.63,42.35 R5.1 | v87.38,44.45 87.38,44.84 C23.2 85.93,45.61 85.09,44.77 80.64,44.77 80.49,44.93 80.49,46.56 C30.2 80.91,47.72 C4.2 C5.2 82.97,53.87 R1.2
  pour Route15: 67.56,66.8 63.5,62.74 63.5,42.16 67.82,37.85 110.24,37.85 113.54,41.15 113.54,64.01 113.54,64.26 111,66.8
N$1  (via drill 0.36)
  Top 0.152: v84.36,61.75 84.38,61.75 84.67,62.05 IC3.138
  Bottom 0.152: v84.36,61.75 84.67,61.44 R1.1
N$2
  Top 0.152: R14.2 104.24,39.89 LED2.C
N$3
  Top 0.152: C34.1 98.74,39.69 99.69,40.64 99.69,42.55 99.54,42.7 98.93,42.7 98.67,42.45 IC3.71
N$4  (via drill 0.36)
  Top 0.152: IC3.76 101.28,45.09 102.17,45.09 103.19,44.07 103.19,43.34 102.39,42.55 v101.76,42.55
  Bottom 0.152: v101.76,42.55 100.81,42.55 C20.1
N$5
  Top 0.152: D1.C 75.56,59.05 73.66,59.05 R3.2
N$6
  Top 0.152: IC3.106 101.95,60.07 103.12,58.9 C31.1
N$7
  Top 0.152: IC4.1 103.66,46.04 101.28,46.04 IC3.78
N$8
  Top 0.152: IC4.2 103.66,45.56 101.28,45.56 IC3.77
N$9
  Top 0.152: D1.A 75.94,61.07 IC3.1
N$10  (via drill 0.36)
  Top 0.152: v85.25,45.88 84.45,45.09 79.69,45.09 IC3.33 78.89,45.07 76.23,42.42 C28.1
  Bottom 0.152: 85.25,48.58 84.77,49.05 FCM1608KF.2 | 85.25,48.58 84.14,47.47 R34.1 85.25,46.16 v85.25,45.88 | 85.25,48.58 86.47,47.36 C23.1
N$11
  Top 0.152: IC4.6 105.25,46.04 108.11,46.04 J1.3
N$12
  Top 0.152: Y1.1 73.18,50.48 73.18,52.7 R2.1 73.03,52.86 73.03,55.24 C1.1
N$13
  Top 0.152: IC4.5 105.25,45.4 108.11,45.4 J1.2
N$14
  Top 0.152: IC3.143 82.17,62.35 81.8,61.98 80.86,61.98 77.81,65.02 R4.1 75.53,64.01 72.99,64.01 R6.1
N$17  (via drill 0.36)
  Top 0.152: v102.55,43.66 102.55,43.97 101.92,44.61 101.28,44.61 IC3.75
  Bottom 0.152: v102.55,43.66 102.71,43.66 103.5,44.45 R5.2
N$19  (via drill 0.36)
  Top 0.152: v82.39,45.72 82.23,45.56 IC3.32 78.75,45.57 77.15,43.97 77.08,43.94 C29.2
  Bottom 0.152: 82.39,45.56 83.98,45.56 R34.2 | 82.39,45.56 81.28,45.56 C30.1 | v82.39,45.72 82.39,45.56
N$22
  Top 0.152: U9.4 68.58,49.85 70.17,49.85 70.48,50.16 C41.1
NRST  (via drill 0.36)
  Top 0.152: v97.79,61.28 85.57,49.05 79.69,49.05 IC3.25
  Bottom 0.152: v97.79,61.28 99.69,63.18 105.22,63.18 J3.5
SCL  (via drill 0.36)
  Top 0.152: v69.06,54.93 68.1,54.93 U11.3 | v67.15,61.44 67.94,61.44 U10.3 | v85.88,61.75 85.72,61.75 85.72,63.02 IC3.136
  Bottom 0.152: R31.1 70.8,50.96 69.06,52.7 v69.06,54.93 67.15,56.83 v67.15,61.44 69.15,63.44 84.2,63.44 v85.88,61.75
SDA  (via drill 0.36)
  Top 0.152: v70.01,54.29 68.1,54.29 U11.4 | v69.22,60.64 68.9,60.96 68.1,60.96 U10.4 | v83.34,61.12 84.75,61.12 85.17,61.54 IC3.137
  Bottom 0.152: R30.1 73.34,50.96 v70.01,54.29 69.85,54.45 69.85,55.09 | v69.22,60.64 69.22,55.72 69.85,55.09 | v83.34,61.12 75.09,61.12 72.55,58.58 72.55,55.4 72.23,55.09 70.1,55.09 69.85,55.09
SWCLK  (via drill 0.36)
  Top 0.152: v100.01,62.55 99.69,62.55 99.22,63.02 IC3.109
  Bottom 0.152: v100.01,62.55 100.01,60.77 J3.2
SWDIO
  Top 0.152: J3.4 106.68,59.05 105.57,57.94 102.49,57.94 102.18,58.26 102.18,59.32 101.92,59.57 IC3.105
SWO  (via drill 0.36)
  Top 0.152: v87.15,61.75 87.15,63.02 IC3.133
  Bottom 0.152: v87.15,61.75 97.31,61.75 99.82,64.26 J3.6
V5  (via drill 0.36)
  Top 0.152: J1.1 108.11,44.61 106.93,43.43 D2.1 106.29,41.78 LED2.A 105.98,40.69 102.5,40.69 v99.38,43.81 99.41,43.81 99.67,44.07 IC3.74 | 68.58,48.26 68.58,48.74 U9.2 68.58,48.9 68.58,49.21 U9.3 | 68.58,48.26 68.9,47.94 70.53,47.94 C40.1 71.83,47.87 v71.91,47.78 | 68.58,48.26 U9.1
  Bottom 0.152: v71.91,47.78 73.34,47.78 77.47,43.66 93.63,43.66 94.88,44.9 IC1.3 95.57,44.93 98.92,44.93 C42.1 99.38,44.53 v99.38,43.81
VCC_1  (via drill 0.36)
  Top 0.152: U9.10 65.56,48.26 v65.56,46.83 65.41,46.67 65.41,46.58 65.41,43.75 65.72,43.43 C39.1
  Bottom 0.152: v65.56,46.83 68.51,46.83 R31.2 R30.2 74.68,50.46 | R23.2 R29.2 74.68,50.46 | 74.68,50.46 R33.2 R32.2
VCC_2  (via drill 0.36)
  Top 0.152: U11.5 67.94,53.82 v66.52,53.82 66.36,53.82 65.09,52.55 65.09,49.09 65.4,48.78 U9.9 | v66.52,60.48 67.94,60.48 U10.5 | v66.2,47.62 66.2,45.72 C38.1
  Bottom 0.152: v66.52,60.48 v66.52,53.82 66.2,53.5 v66.2,47.62
VDD  (via drill 0.36)
  Top 0.152: 79.76,46.51 79.69,46.51 IC3.30 | C6.1 92.55,65.09 91.76,65.88 88.58,65.88 87.79,65.09 C2.1 87.63,65.09 86.84,65.88 82.55,65.88 81.76,65.09 C17.1 | C12.1 77.79,52.23 78.63,53.07 IC3.17 80.4,53.07 80.77,53.45 80.77,58.57 | C22.1 77.79,58.42 77.95,58.58 79.53,58.58 IC3.6 80.77,58.57 | IC3.86 102.54,50.07 C18.1 104.03,51.56 J3.1 103.12,55.12 C7.1 102.67,55.23 102.04,54.61 101.28,54.61 IC3.95 100.22,54.57 99.92,54.86 99.92,60.64 100.35,61.07 IC3.108 101.28,61.12 101.44,61.12 103.03,62.71 C24.1 | 88.42,62.07 93.03,62.07 93.17,62.22 IC3.121 | C13.1 77.47,47.87 78.82,46.51 79.76,46.51 | C17.1 v80.52,65.02 79.74,65.8 75.62,65.8 R4.2 | C17.1 81.58,64.93 81.67,64.84 IC3.144 | 80.77,58.57 84.93,58.57 84.93,58.58 | 88.42,62.07 88.17,62.32 IC3.131 | 84.93,58.58 88.42,62.07 | 79.76,46.51 90.14,46.51 v91.69,44.96 94.17,42.48 IC3.62 94.17,40.62 93.94,40.39 | 84.93,58.58 v85.6,57.91 | IC3.39 82.67,40.12 C14.1 83.94,40.39 89.01,40.39 | 89.01,40.39 C15.1 90.54,40.39 93.69,40.39 93.94,40.39 | IC3.52 89.17,40.56 89.01,40.39 | IC3.72 99.17,40.76 98.81,40.39 95.62,40.39 C16.1 94.09,40.39 93.94,40.39
  Bottom 0.152: 83.12,51.82 84.14,50.8 84.16,50.77 | 83.12,51.82 | 93.19,49.37 95.89,52.07 106.2,52.07 106.68,51.59 J3.1 | C19.1 99.82,48.12 C43.1 IC1.2 95.31,47.24 93.19,49.37 | 93.19,49.37 86.61,49.37 FCM1608KF.1 85.77,49.17 84.16,50.77 | 83.12,51.82 C5.1 | 84.16,50.77 C4.1
  pour Route2: 66.55,65.79 63.5,62.74 63.5,42.16 67.82,37.85 110.24,37.85 113.54,41.15 113.54,64.26 111,66.8 67.56,66.8